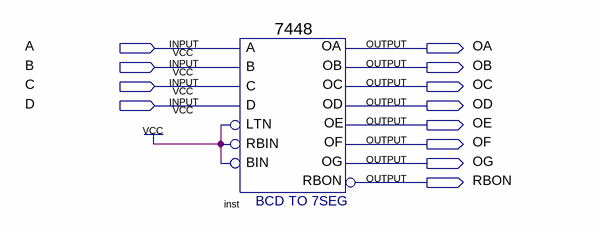
[diagram p0: schematic sheet]
// Quartus schematic 44.bdf as structural Verilog: 1 symbols, 12 pins
module \44  (
  input  A,
  input  B,
  input  C,
  input  D,
  output OA,
  output OB,
  output OC,
  output OD,
  output OE,
  output OF,
  output OG,
  output RBON
);

  \7448  inst (
    .A(A), .C(C), .D(D), .B(B), .RBIN(1'b1), .BIN(1'b1), .LTN(1'b1), .OC(OC), .OE(OE), .OD(OD), .OF(OF),
    .OG(OG), .OB(OB), .OA(OA), .RBON(RBON));
endmodule
